# Altium project tsal_v1.PrjPcb
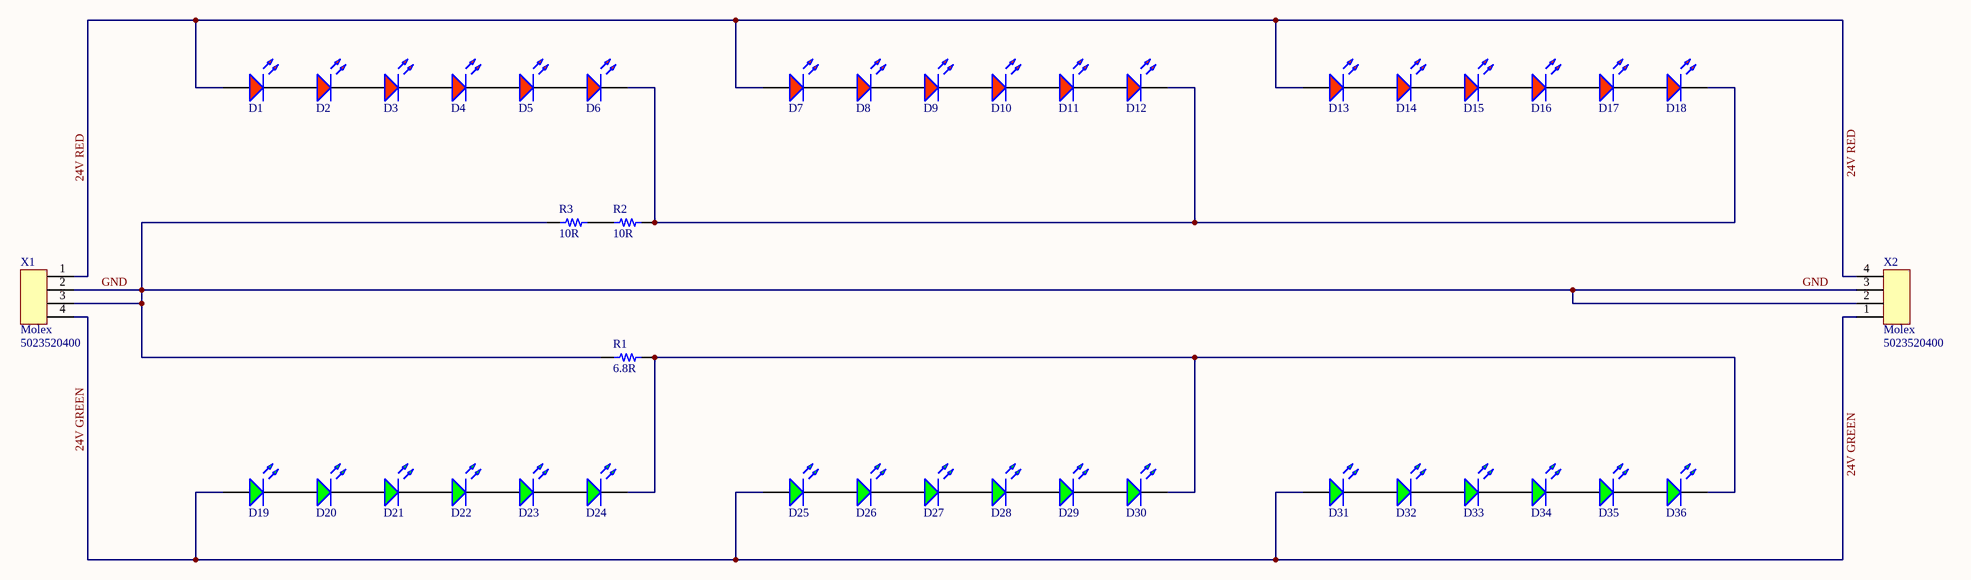
[diagram p0: tsal_v1.SchDoc]
title: BMS Slave V4
1 sheet, 41 parts. Net scope: hierarchical (ports join the sheet entries above them; power ports are global).
Board file: tsal_v1.PcbDoc

## Sheet tsal_v1.SchDoc: BMS Slave V4
size A3

### Parts
D1  LED XLAMP RED 1616 SMD  [led red 0606]  (value not drawn)
D2  LED XLAMP RED 1616 SMD  [led red 0606]  (value not drawn)
D3  LED XLAMP RED 1616 SMD  [led red 0606]  (value not drawn)
D4  LED XLAMP RED 1616 SMD  [led red 0606]  (value not drawn)
D5  LED XLAMP RED 1616 SMD  [led red 0606]  (value not drawn)
D6  LED XLAMP RED 1616 SMD  [led red 0606]  (value not drawn)
D7  LED XLAMP RED 1616 SMD  [led red 0606]  (value not drawn)
D8  LED XLAMP RED 1616 SMD  [led red 0606]  (value not drawn)
D9  LED XLAMP RED 1616 SMD  [led red 0606]  (value not drawn)
D10  LED XLAMP RED 1616 SMD  [led red 0606]  (value not drawn)
D11  LED XLAMP RED 1616 SMD  [led red 0606]  (value not drawn)
D12  LED XLAMP RED 1616 SMD  [led red 0606]  (value not drawn)
D13  LED XLAMP RED 1616 SMD  [led red 0606]  (value not drawn)
D14  LED XLAMP RED 1616 SMD  [led red 0606]  (value not drawn)
D15  LED XLAMP RED 1616 SMD  [led red 0606]  (value not drawn)
D16  LED XLAMP RED 1616 SMD  [led red 0606]  (value not drawn)
D17  LED XLAMP RED 1616 SMD  [led red 0606]  (value not drawn)
D18  LED XLAMP RED 1616 SMD  [led red 0606]  (value not drawn)
D19  LED XLAMP GREEN 1616 SMD  [led red 0606]  (value not drawn)
D20  LED XLAMP GREEN 1616 SMD  [led red 0606]  (value not drawn)
D21  LED XLAMP GREEN 1616 SMD  [led red 0606]  (value not drawn)
D22  LED XLAMP GREEN 1616 SMD  [led red 0606]  (value not drawn)
D23  LED XLAMP GREEN 1616 SMD  [led red 0606]  (value not drawn)
D24  LED XLAMP GREEN 1616 SMD  [led red 0606]  (value not drawn)
D25  LED XLAMP GREEN 1616 SMD  [led red 0606]  (value not drawn)
D26  LED XLAMP GREEN 1616 SMD  [led red 0606]  (value not drawn)
D27  LED XLAMP GREEN 1616 SMD  [led red 0606]  (value not drawn)
D28  LED XLAMP GREEN 1616 SMD  [led red 0606]  (value not drawn)
D29  LED XLAMP GREEN 1616 SMD  [led red 0606]  (value not drawn)
D30  LED XLAMP GREEN 1616 SMD  [led red 0606]  (value not drawn)
D31  LED XLAMP GREEN 1616 SMD  [led red 0606]  (value not drawn)
D32  LED XLAMP GREEN 1616 SMD  [led red 0606]  (value not drawn)
D33  LED XLAMP GREEN 1616 SMD  [led red 0606]  (value not drawn)
D34  LED XLAMP GREEN 1616 SMD  [led red 0606]  (value not drawn)
D35  LED XLAMP GREEN 1616 SMD  [led red 0606]  (value not drawn)
D36  LED XLAMP GREEN 1616 SMD  [led red 0606]  (value not drawn)
R1  value 6.8R  [R2512 pad under]  (hidden comment: RES SMD 6.8 OHM 1% 16W 2512)
R2  value 10R  [R2512 pad under]  (hidden comment: RES SMD 10 OHM 1% 16W 2512)
R3  value 10R  [R2512 pad under]  (hidden comment: RES SMD 10 OHM 1% 16W 2512)
X1  Manufacturer: Molex  [5023520400]  (hidden comment: Connector)
X2  Manufacturer: Molex  [5023520400]  (hidden comment: Connector)

### Nets
24V GREEN: D19.1(A) D25.1(A) D31.1(A) X1.4 X2.1
24V RED: D1.1 D7.1 D13.1 X1.1 X2.4
GND: R1.1 R3.1 X1.2 X1.3 X2.2 X2.3
NetD1_2: D1.2 D2.1
NetD2_2: D2.2 D3.1
NetD3_2: D3.2 D4.1
NetD4_2: D4.2 D5.1
NetD5_2: D5.2 D6.1
NetD6_2: D6.2 D12.2 D18.2 R2.2
NetD7_2: D7.2 D8.1
NetD8_2: D8.2 D9.1
NetD9_2: D9.2 D10.1
NetD10_2: D10.2 D11.1
NetD11_2: D11.2 D12.1
NetD13_2: D13.2 D14.1
NetD14_2: D14.2 D15.1
NetD15_2: D15.2 D16.1
NetD16_2: D16.2 D17.1
NetD17_2: D17.2 D18.1
NetD19_2: D19.2(K) D20.1(A)
NetD20_2: D20.2(K) D21.1(A)
NetD21_2: D21.2(K) D22.1(A)
NetD22_2: D22.2(K) D23.1(A)
NetD23_2: D23.2(K) D24.1(A)
NetD24_2: D24.2(K) D30.2(K) D36.2(K) R1.2
NetD25_2: D25.2(K) D26.1(A)
NetD26_2: D26.2(K) D27.1(A)
NetD27_2: D27.2(K) D28.1(A)
NetD28_2: D28.2(K) D29.1(A)
NetD29_2: D29.2(K) D30.1(A)
NetD31_2: D31.2(K) D32.1(A)
NetD32_2: D32.2(K) D33.1(A)
NetD33_2: D33.2(K) D34.1(A)
NetD34_2: D34.2(K) D35.1(A)
NetD35_2: D35.2(K) D36.1(A)
NetR2_1: R2.1 R3.2

### Library data of the parts
D1-D18 = XQARED-02-0000-000000W01: LED Lighting Color Xlamp® XQ-A Red 625nm (620nm ~ 630nm) 0606 (1616 Metric); Manufacturer: Comchip Technology; Supplier_Link: https://www.digikey.ca/product-detail/en/cree-inc/XQARED-02-0000-000000W01/XQARED-02-0000-000000W01CT-ND/5806748; Price: 0.81; Price_10: 0.762; Supplier 1: Digi-Key; Part_Number: XQARED-02-0000-000000W01; Supplier Part Number 1: XQARED-02-0000-000000W01CT-ND
D19-D36 = XQAGRN-02-0000-000000Z01: LED Lighting Color Xlamp® XQ-A Green 528nm (520nm ~ 535nm) 0606 (1616 Metric); Manufacturer: Comchip Technology; Supplier_Link: https://www.digikey.ca/product-detail/en/cree-inc/XQAGRN-02-0000-000000Z01/XQAGRN-02-0000-000000Z01CT-ND/5806746; Price: 0.87; Price_10: 0.817; Supplier 1: Digi-Key; Part_Number: XQAGRN-02-0000-000000Z01; Supplier Part Number 1: XQAGRN-02-0000-000000Z01CT-ND
R1 = RES 2512 6.8R 1% 16W: 6.8 Ohms ±1% 16W Chip Resistor 2512 (6432 Metric) Moisture Resistant Thin Film; Manufacturer: Susumu; Part_Number: CPA25Q6.8CT; Supplier_Link: https://www.digikey.com/product-detail/en/susumu/CPA2512Q6R80FS-T10/CPA25Q6.8CT-ND/1935961; Supplier 1: Digi-Key; Supplier Part Number 1: CPA25Q6.8CT-ND; Power: 16W; Tolerance: 1%
R2 R3 = RES 2512 10R 1% 16W: 10 Ohms ±1% 16W Chip Resistor 2512 (6432 Metric) Moisture Resistant Thin Film; Manufacturer: Susumu; Part_Number: CPA25Q10.0CT; Supplier_Link: https://www.digikey.com/product-detail/en/susumu/CPA2512Q10R0FS-T10/CPA25Q10.0CT-ND/1935963; Supplier 1: Digi-Key; Supplier Part Number 1: CPA25Q10.0CT-ND; Power: 16W; Tolerance: 1%
X1 X2 = 5023520400: Molex DuraClik, 4 pos, RA; Part_Number_Crimp: 0502128000; Part_Number_Mating: 5023510400; Mounting_Type: Surface Mount, Right Angle; Supplier_Link: http://www.digikey.com/product-detail/en/molex-llc/5023520400/WM7171CT-ND/3045198; Supplier_Link_Crimp: http://www.digikey.com/product-detail/en/molex-llc/0502128000/WM4561CT-ND/2524899; Supplier_Link_Mating: http://www.digikey.com/product-detail/en/molex-llc/5023510400/WM8688-ND/3045219; Series: DuraClik; Supplier 1: Digikey; Supplier Part Number 1: WM7171CT-ND; Part_Number: 5023520400